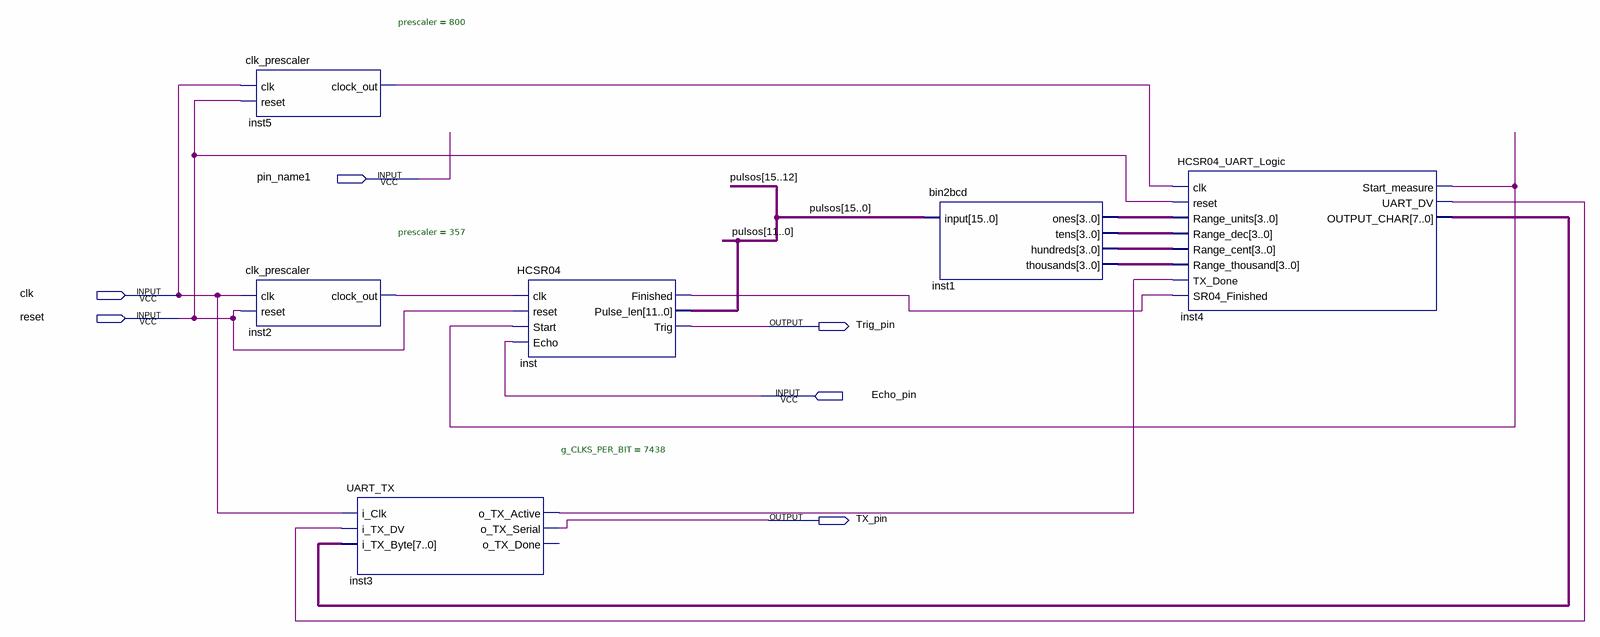
[diagram p0: schematic sheet]
// Quartus schematic ultrasonic_serial.bdf as structural Verilog: 6 symbols, 6 pins
module ultrasonic_serial (
  input  pin_name1,
  input  clk,
  input  reset,
  input  Echo_pin,
  output Trig_pin,
  output TX_pin
);

  wire inst2_clock_out, inst3_o_tx_active, inst4_start_measure, inst4_uart_dv, inst5_clock_out, inst_finished;
  wire [3:0] inst1_hundreds, inst1_ones, inst1_tens, inst1_thousands;
  wire [7:0] inst4_output_char;
  wire [15:0] pulsos;

  clk_prescaler #(.prescaler(800)) inst5 (.clk(clk), .reset(reset), .clock_out(inst5_clock_out));
  clk_prescaler #(.prescaler(357)) inst2 (.clk(clk), .reset(reset), .clock_out(inst2_clock_out));
  UART_TX #(.g_CLKS_PER_BIT(7438)) inst3 (
    .i_Clk(clk), .i_TX_DV(inst4_uart_dv), .i_TX_Byte(inst4_output_char), .o_TX_Active(inst3_o_tx_active),
    .o_TX_Serial(TX_pin));  // open: o_TX_Done
  HCSR04 inst (
    .clk(inst2_clock_out), .reset(reset), .Start(inst4_start_measure), .Echo(Echo_pin),
    .Finished(inst_finished), .Pulse_len(pulsos), .Trig(Trig_pin));
  bin2bcd inst1 (
    .\input (pulsos), .ones(inst1_ones), .tens(inst1_tens), .hundreds(inst1_hundreds),
    .thousands(inst1_thousands));
  HCSR04_UART_Logic inst4 (
    .clk(inst5_clock_out), .reset(reset), .Range_units(inst1_ones), .Range_dec(inst1_tens),
    .Range_cent(inst1_hundreds), .Range_thousand(inst1_thousands), .TX_Done(inst3_o_tx_active),
    .SR04_Finished(inst_finished), .Start_measure(inst4_start_measure), .UART_DV(inst4_uart_dv),
    .OUTPUT_CHAR(inst4_output_char));
endmodule
